# Altium schematic sheet SALIDA_DAC.SchDoc
size A4
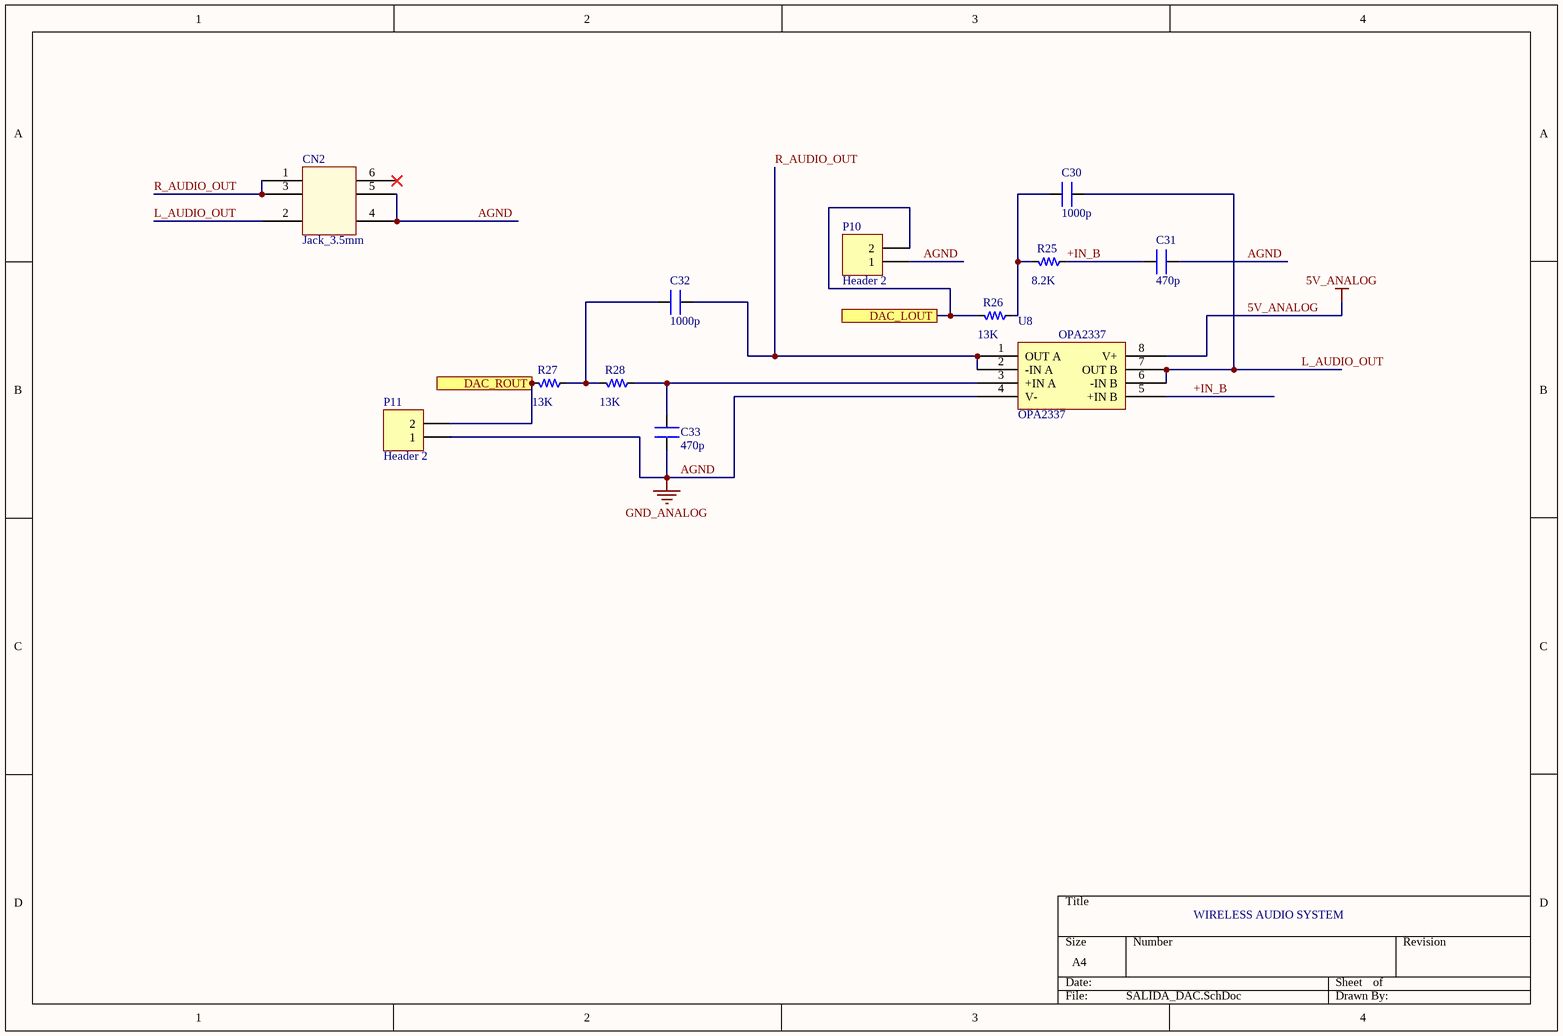
[diagram p0: SALIDA_DAC.SchDoc]

## Parts
C30  1000p  [C_0805]
C31  470p  [C_0805]
C32  1000p  [C_0805]
C33  470p  [C_0805]
CN2  Jack_3.5mm  [JACK_3.5mm]
P10  Header 2  [Header1x2]
P11  Header 2  [Header1x2]
R25  8.2K  [R_0805]
R26  13K  [R_0805]
R27  13K  [R_0805]
R28  13K  [R_0805]
U8  OPA2337  [SOIC-8N]

## Ports
DAC_LOUT, DAC_ROUT

## Nets
5V_ANALOG: U8.8(V+)
AGND: C31.2 C33.2 CN2.4 CN2.5 P10.1 P11.1 U8.4(V-)  [also labelled GND_ANALOG]
+IN_B: C31.1 R25.2 U8.5(+IN_B)
DAC_LOUT: P10.2 R26.1 ; port DAC_LOUT
DAC_ROUT: P11.2 R27.1 ; port DAC_ROUT
L_AUDIO_OUT: C30.2 CN2.2 U8.6(-IN_B) U8.7(OUT_B)
R_AUDIO_OUT: C32.2 CN2.1 CN2.3 U8.1(OUT_A) U8.2(-IN_A)
NetC30_1: C30.1 R25.1 R26.2
NetC32_1: C32.1 R27.2 R28.1
NetC33_1: C33.1 R28.2 U8.3(+IN_A)

Not connected (* = marked no-connect by the designer): CN2 6*

## Notes on the sheet
- WIRELESS AUDIO SYSTEM

## Library data of the parts
C30-C33 = Capacitor_NP: Non Polarised Capacitor
P10 P11 = Header 2: Header, 2-Pin; LatestRevisionDate: 17-Jul-2002; LatestRevisionNote: Re-released for DXP Platform.; Publisher: Altium Limited
R25-R28 = Resistor